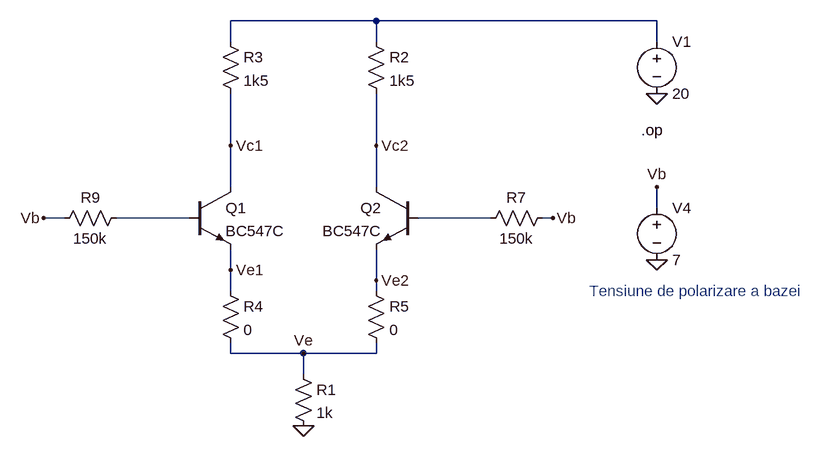
[diagram p0: schematic circuit_polarizare_rezistor.asc]
circuit_polarizare_rezistor.asc, the LTspice schematic file:
Version 4
SHEET 1 1140 680
WIRE 384 -80 160 -80
WIRE 816 -80 384 -80
WIRE 160 -48 160 -80
WIRE 384 -48 384 -80
WIRE 816 -48 816 -80
WIRE 160 112 160 32
WIRE 384 112 384 32
WIRE 160 176 160 112
WIRE 384 176 384 112
WIRE 816 208 816 176
WIRE -96 224 -128 224
WIRE 96 224 -16 224
WIRE 560 224 448 224
WIRE 656 224 640 224
WIRE 160 304 160 272
WIRE 384 320 384 272
WIRE 160 336 160 304
WIRE 384 336 384 320
WIRE 160 432 160 416
WIRE 272 432 160 432
WIRE 384 432 384 416
WIRE 384 432 272 432
WIRE 272 464 272 432
FLAG 816 32 0
FLAG 272 544 0
FLAG 160 112 Vc1
FLAG 384 112 Vc2
FLAG 272 432 Ve
FLAG 816 288 0
FLAG 816 176 Vb
FLAG -128 224 Vb
FLAG 656 224 Vb
FLAG 160 304 Ve1
FLAG 384 320 Ve2
SYMBOL npn 96 176 R0
SYMATTR InstName Q1
SYMATTR Value BC547C
SYMBOL npn 448 176 M0
SYMATTR InstName Q2
SYMATTR Value BC547C
SYMBOL res 368 -64 R0
SYMATTR InstName R2
SYMATTR Value 1k5
SYMATTR SpiceLine tol=1
SYMBOL res 144 -64 R0
SYMATTR InstName R3
SYMATTR Value 1k5
SYMATTR SpiceLine tol=1
SYMBOL voltage 816 -64 R0
WINDOW 123 0 0 Left 2
WINDOW 39 0 0 Left 2
SYMATTR InstName V1
SYMATTR Value 20
SYMBOL res 144 320 R0
SYMATTR InstName R4
SYMATTR Value 0
SYMBOL res 368 320 R0
SYMATTR InstName R5
SYMATTR Value 0
SYMBOL voltage 816 192 R0
WINDOW 123 0 0 Left 2
WINDOW 39 0 0 Left 2
SYMATTR InstName V4
SYMATTR Value 7
SYMBOL res 656 208 R90
WINDOW 0 0 56 VBottom 2
WINDOW 3 32 56 VTop 2
SYMATTR InstName R7
SYMATTR Value 150k
SYMBOL res 0 208 R90
WINDOW 0 0 56 VBottom 2
WINDOW 3 32 56 VTop 2
SYMATTR InstName R9
SYMATTR Value 150k
SYMBOL res 256 448 R0
SYMATTR InstName R1
SYMATTR Value 1k
TEXT 792 88 Left 2 !.op
TEXT 712 336 Left 2 ;Tensiune de polarizare a bazei

The netlist it stands for:
* circuit_polarizare_rezistor.asc
Q1 Vc1 N002 Ve1 0 BC547C
Q2 Vc2 N003 Ve2 0 BC547C
R2 N001 Vc2 1k5 tol=1
R3 N001 Vc1 1k5 tol=1
V1 N001 0 20
R4 Ve1 Ve 0
R5 Ve2 Ve 0
V4 Vb 0 7
R7 Vb N003 150k
R9 N002 Vb 150k
R1 Ve 0 1k
.model NPN NPN
.model PNP PNP
.lib standard.bjt
.op
* Tensiune de polarizare a bazei
.backanno
.end